# EAGLE design xiao_rp2040_round_lcd (EAGLE 7.7.0)
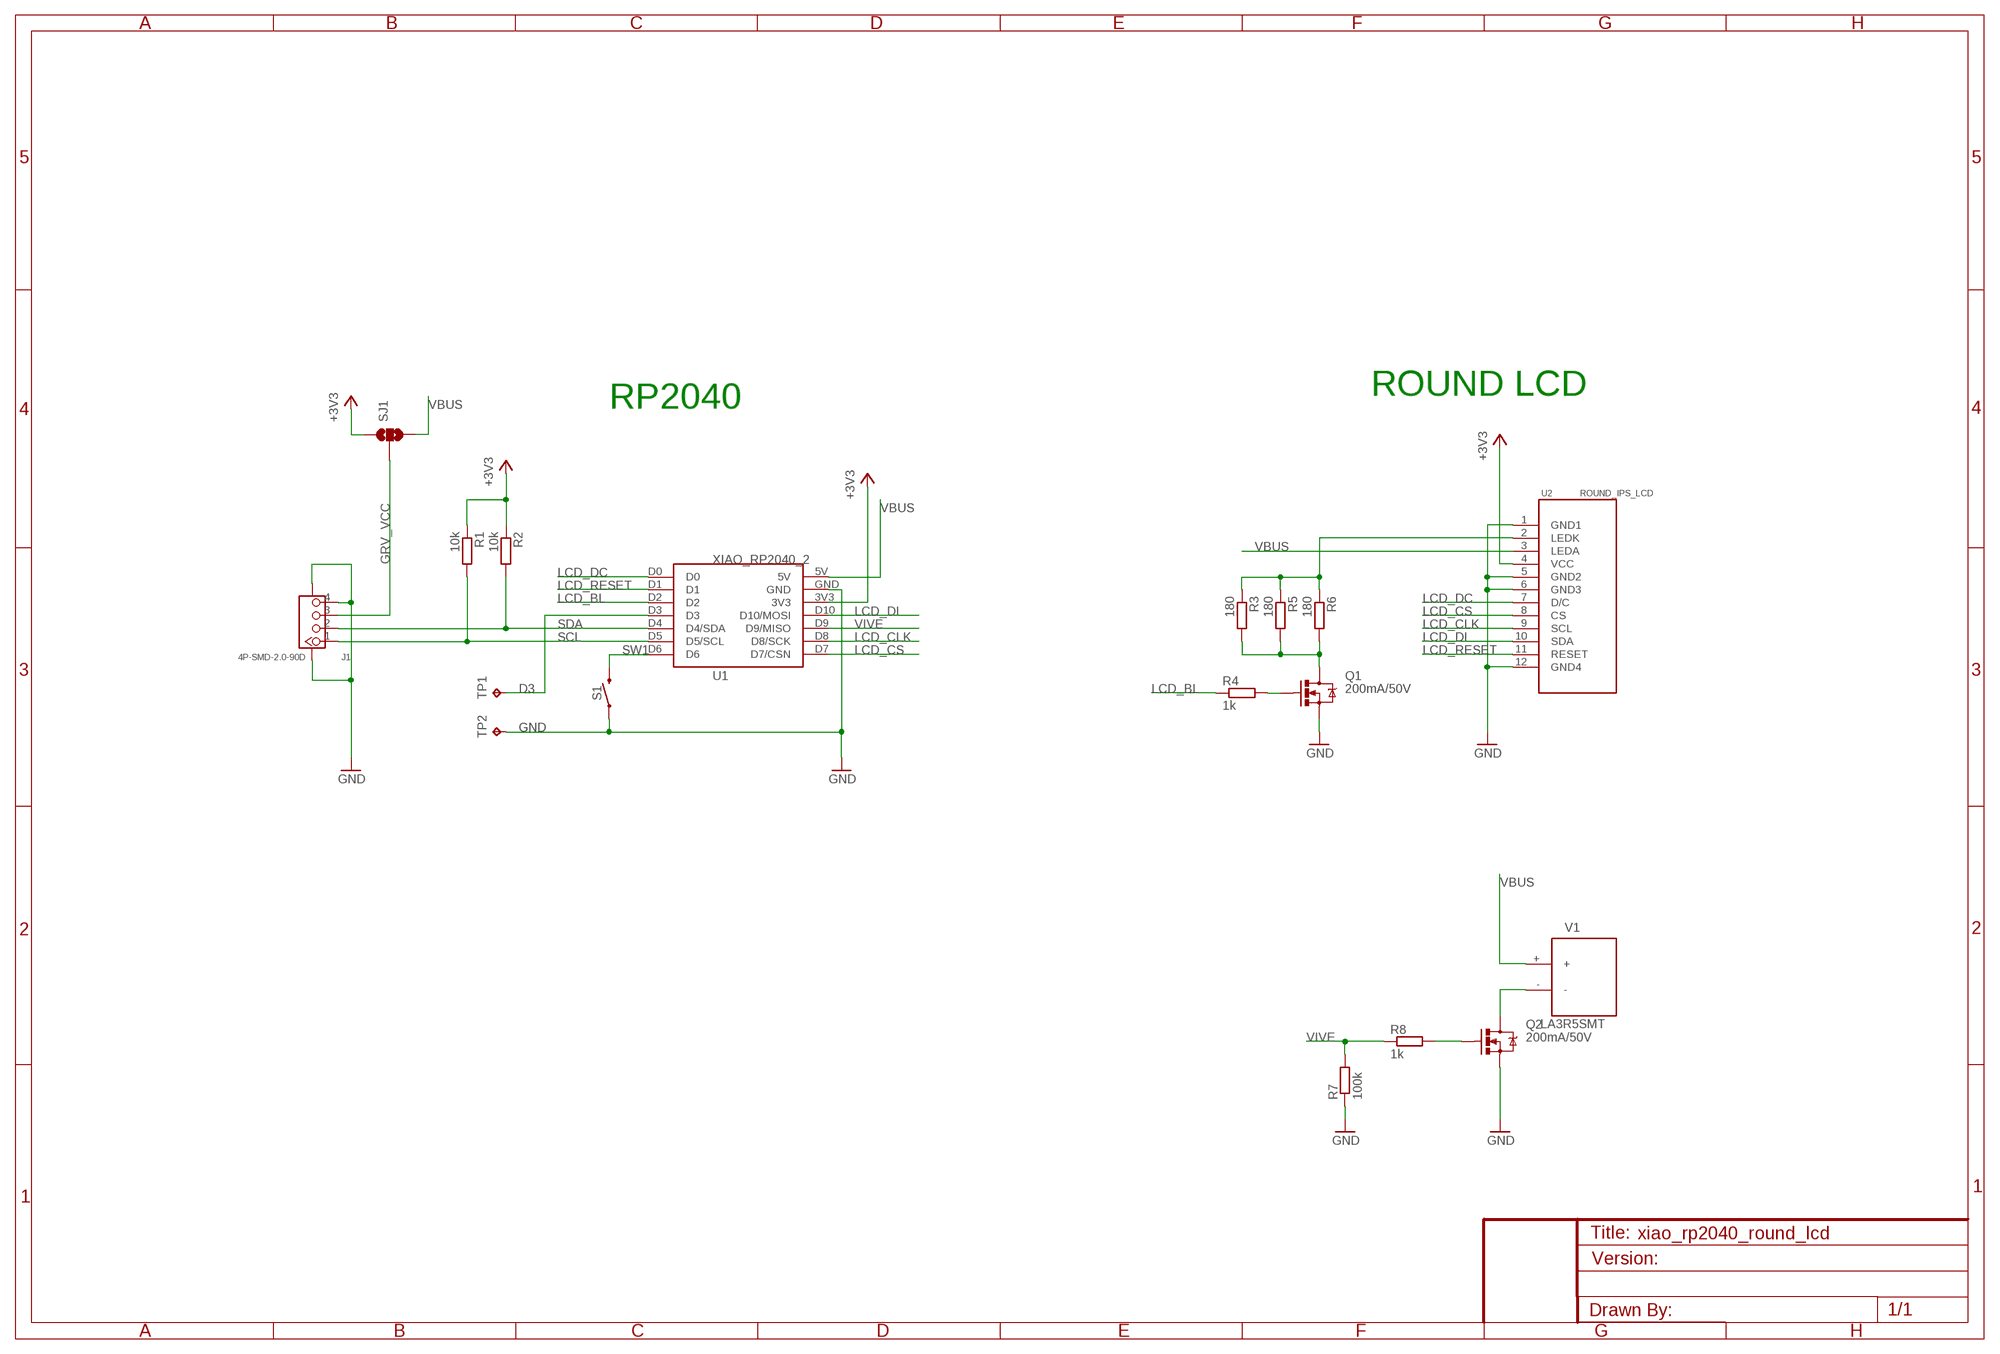
[diagram p0: schematic, sheet 1]

## Parts
J1  4P-SMD-2.0-90D  GROVE-CONNECTOR-SMD-90D(4+2P-2.0)  [HW4-SMD-2.0-90D]
Q1  200mA/50V  MOSFET-NCHANNELBSS138  [SOT23-3]
Q2  200mA/50V  MOSFET-NCHANNELBSS138  [SOT23-3]
R1  10k  R-EU_R0603  [R0603]
R2  10k  R-EU_R0603  [R0603]
R3  180  R-EU_R0603  [R0603]
R4  1k  R-EU_R0603  [R0603]
R5  180  R-EU_R0603  [R0603]
R6  180  R-EU_R0603  [R0603]
R7  100k  R-EU_R0603  [R0603]
R8  1k  R-EU_R0603  [R0603]
S1  TACT_SW_3X4  [TACTILE_SWITCH_SMD_3X4MM]
SJ1  SOLDERJUMPER_2WAYS  [SJ_3]
TP1  TPTP18R  [TP18R]
TP2  TPTP18R  [TP18R]
U1  XIAO_RP2040_2  [XIAO_RP2040_2]
U2  ROUND_IPS_LCD  [ROUND_IPS_LCD]
V1  LA3R5SMT  [LA3R5-2]

## Nets
+3V3 [pow]: R1.1 R2.1 SJ1.1 U1.3V3 U2.4(VCC)
D3: TP1.TP U1.D3
GND: J1.4 J1.SS1 J1.SS2 Q1.2(S) Q2.2(S) R7.1 S1.1 S1.2 TP2.TP U1.GND U2.1(GND1) U2.5(GND2) U2.6(GND3) U2.12(GND4)
GRV_VCC [usbvcc]: J1.3 SJ1.2
LCD_BL: R4.1 U1.D2
LCD_CLK: U1.D8(D8/SCK) U2.9(SCL)
LCD_CS: U1.D7(D7/CSN) U2.8(CS)
LCD_DC: U1.D0 U2.7(D/C)
LCD_DI: U1.D10(D10/MOSI) U2.10(SDA)
LCD_RESET: U1.D1 U2.11(RESET)
LED_K [usbvcc]: R3.1 R5.1 R6.1 U2.2(LEDK)
N$1: Q1.1(G) R4.2
N$2 [usbvcc]: Q1.3(D) R3.2 R5.2 R6.2
N$4: Q2.3(D) V1.-
N$5: Q2.1(G) R8.2
SCL: J1.1 R1.2 U1.D5(D5/SCL)
SDA: J1.2 R2.2 U1.D4(D4/SDA)
SW1: S1.3 S1.4 U1.D6
VBUS [usbvcc]: SJ1.3 U1.5V U2.3(LEDA) V1.+
VIVE: R7.2 R8.1 U1.D9(D9/MISO)

## Notes on the sheet
- ROUND LCD
- RP2040

## Library data of the parts
J1 = Seeed-OPL-Connector:GROVE-CONNECTOR-SMD-90D(4+2P-2.0): 320110032
Q1 Q2 = suna_lib:MOSFET-NCHANNEL: Common NMOSFET Parts MFG P/N Store ID Prod ID FDD8780 TRANS-09984 SI7820DN TRANS-11055 FDS6630A IC-08089 2N7002PW TRANS-11151 FQP30N06L COM-10213 TRANS-10060 BSS123LT1G TRANS-08345 BSS138 TRANS-00830 BS170 2N7000; PROD_ID: TRANS-00830
R1-R8 = resistor:R-EU_: RESISTOR, European symbol
S1 = suna_lib:TACT_SW_3X4
SJ1 = SparkFun-Retired:SOLDERJUMPER_2WAY: Solder Jumper 2 way solder jumper
TP1 TP2 = suna_lib:TP: Test pad
U1 = suna_lib:XIAO_RP2040
U2 = suna_lib:ROUND_IPS_LCD
V1 = suna_lib:LA3R5

## Net classes
1 pow: width 0.508 mm
2 GND: width 0.61 mm
3 usbvcc: width 0.508 mm, clearance 0.254 mm
4 aref: width 0.406 mm, clearance 0.254 mm

## Board
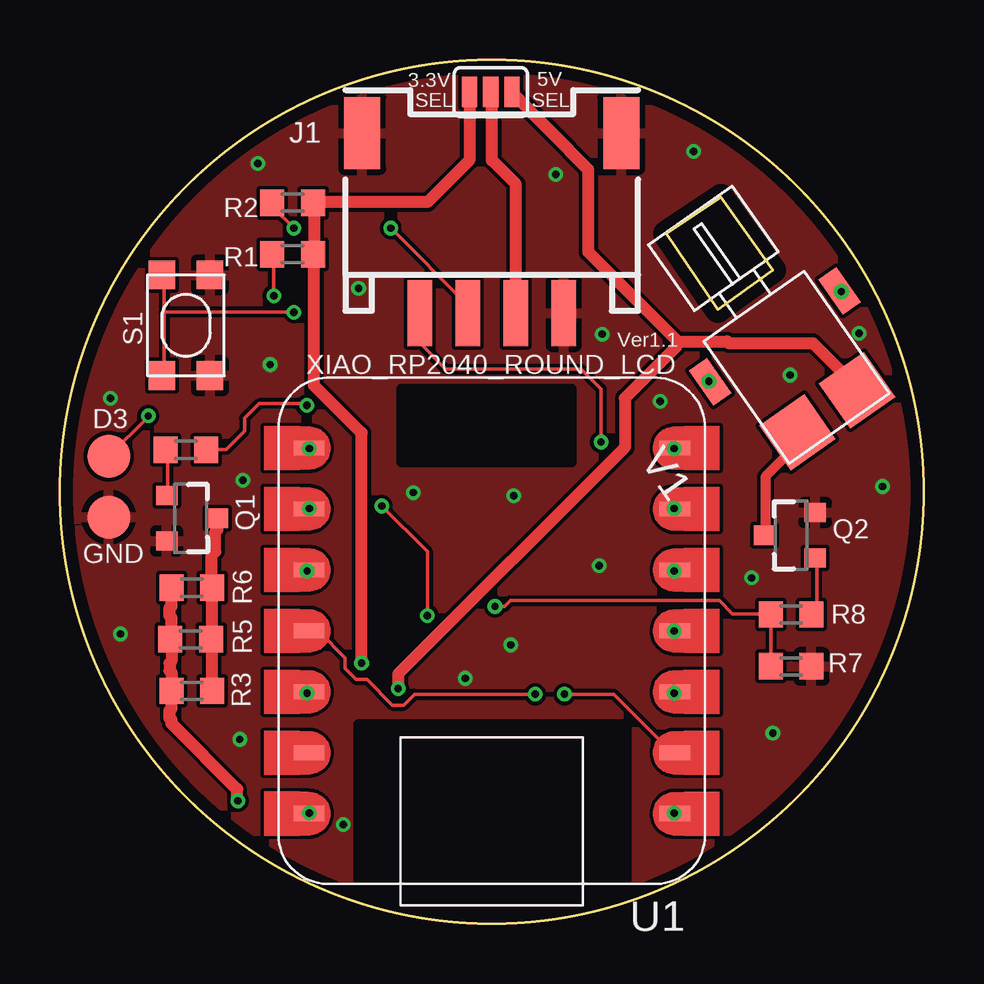
[diagram p1: board, top side]
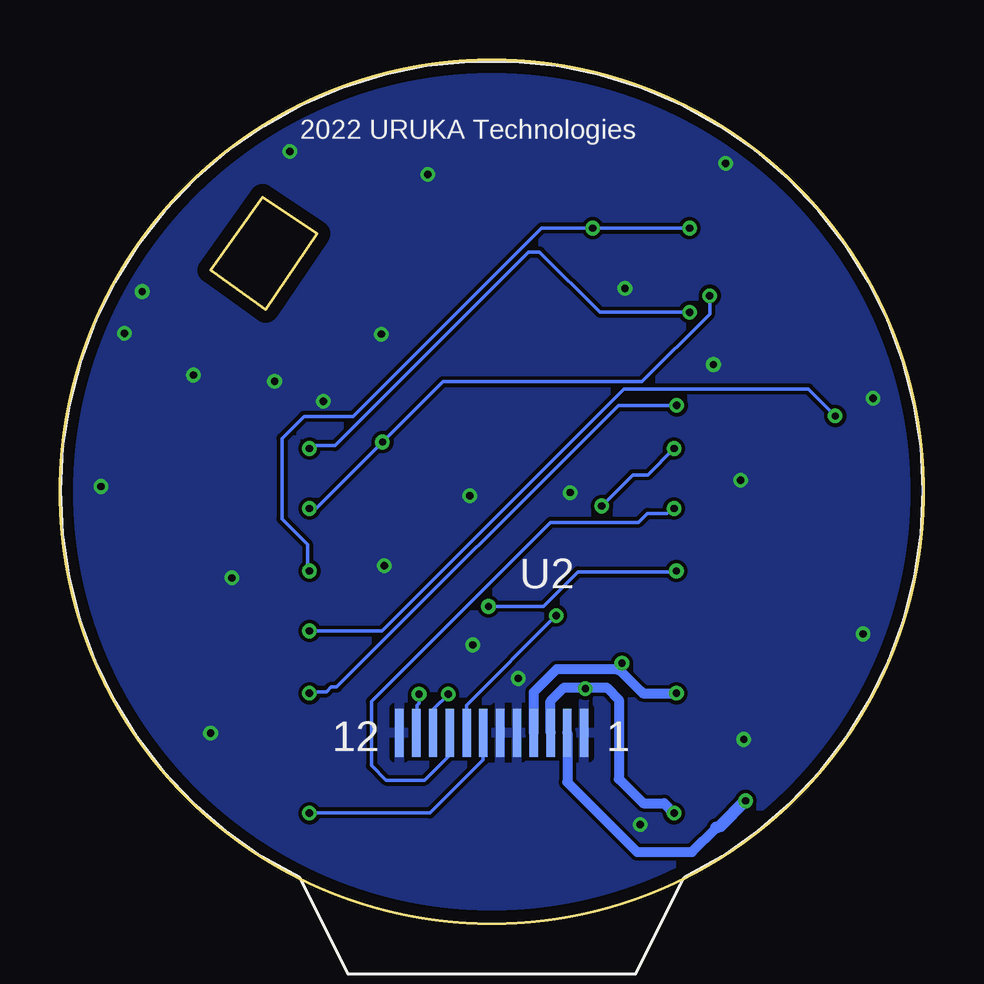
[diagram p2: board, bottom side, seen from below]

Size 36 x 36 mm. Coordinates in mm from the lower left corner, seen from the top.
Outline: 27.56,30.28 25.27,28.76 27.43,25.59 29.72,27.24 27.56,30.28
Outline: circle at 18,18 radius 18
Copper layers (1*16): Top 0.035mm / dielectric 1.53mm / Bottom 0.035mm
Design rules "seeed_pban_5mil": minimum track width 6mil, minimum drill 12mil, track to track 6mil, track to pad 0.229mm, pad to pad 6mil, via to via 6mil, smd to smd 5mil, copper to edge 0.5mm, drill to drill 0.5mm, minimum pad ring 10mil, minimum via ring 6mil, stop-mask expansion 4mil, vias tented up to drill 25mil, thermal gap 10mil
tRestrict: area 12.4,2 to 23.6,8.3; area 14.2,19.2 to 21.3,22.3

### Footprints (pad centres in the part's own frame; a part is rotated, then mirrored left to right if it is on the bottom)
HW4-SMD-2.0-90D = smd 1.01 x 2.74: 1 -3,-0.1; 2 -1,-0.1; 3 1,-0.1; 4 3,-0.1 | smd 1.5 x 3: SS1 -5.4,7.4; SS2 5.4,7.4
SOT23-3 = smd 0.8 x 0.9: 1 -0.95,-1; 2 0.95,-1; 3 0,1.1
R0603 = smd 1 x 1.1: 1 -0.85,0; 2 0.85,0
TACTILE_SWITCH_SMD_3X4MM = smd 1.2 x 1.1: 1 -2.1,-1; 2 2.1,-1; 3 2.1,1; 4 -2.1,1
SJ_3 = smd 0.635 x 1.27: 1 -0.889,0; 2 0,0; 3 0.889,0
TP18R = smd 1.8 x 1.8: TP 0,0
XIAO_RP2040_2 = smd 1.27 x 0.635: 3V3 7.62,2.54; 5V 7.62,7.62; D0 -7.62,7.62; D1 -7.62,5.08; D2 -7.62,2.54; D3 -7.62,0; D4 -7.62,-2.54; D5 -7.62,-5.08; D6 -7.62,-7.62; D7 7.62,-7.62; D8 7.62,-5.08; D9 7.62,-2.54; D10 7.62,0; GND 7.62,5.08
ROUND_IPS_LCD = smd 0.35 x 2: 1 3.85,-9.95; 2 3.15,-9.95; 3 2.45,-9.95; 4 1.75,-9.95; 5 1.05,-9.95; 6 0.35,-9.95; 7 -0.35,-9.95; 8 -1.05,-9.95; 9 -1.75,-9.95; 10 -2.45,-9.95; 11 -3.15,-9.95; 12 -3.85,-9.95
LA3R5-2 = smd 2.286 x 2.286: + -2.54,-1.524; - -2.54,1.524 | smd 1.778 x 0.914: GND1 1.27,3.302; GND2 1.27,-3.302

### Placement (x,y rotation side)
J1  18,25.55 0 top
Q1  5.45,16.9 270 top
Q2  30.48,16.19 90 top
R1  9.7,27.9 180 top
R2  9.7,30.05 180 top
R3  5.5,9.7 0 top
R4  5.25,19.75 180 top
R5  5.45,11.85 0 top
R6  5.5,14 0 top
R7  30.48,10.73 180 top
R8  30.48,12.89 0 top
S1  5.25,24.94 90 top
SJ1  17.96,34.66 0 top
TP1  2.04,19.48 0 top
TP2  2.04,16.94 0 top
U1  18,12.2 180 top
U2  18,17.9 0 bottom
V1  30.53,23.44 125 top

### Tracks (layer width: path | path; a pad name or v marks a point on that pad's centre or on a via)
+3V3  (via drill 0.3)
  Top 0.152: v10.3,9.6 10.3,9.68 U1.3V3
  Top 0.508: v12.57,10.85 12.57,20.45 10.59,22.44 10.59,27.69 R1.1 10.59,27.92 10.59,29.98 R2.1 10.58,30.08 15.32,30.08 17.07,31.83 SJ1.1
  Bottom 0.152: 11.76,9.66 11.7,9.6
  Bottom 0.406: U2.4 16.25,9.65 15.3,10.6 12.7,10.6 11.76,9.66 | 11.7,9.6 10.44,9.6 U1.3V3 10.28,9.58 v10.3,9.6
  Bottom 0.508: v12.57,10.85 12.65,10.78 12.7,10.6
D3  (via drill 0.3)
  Top 0.152: v3.68,21.16 3.68,21.12 TP1.TP | v25.6,12.2 25.62,12.3 U1.D3
  Bottom 0.152: v3.68,21.16 4.8,22.28 12.5,22.28 22.58,12.2 v25.6,12.2
GND  (via drill 0.3)
  other vias: 29.72,7.93 20.66,31.23 8.26,31.68 26.42,32.19 33.31,24.6 30.44,22.86 25.02,21.78 22.61,24.57 8.76,23.3 2.11,21.9 18.92,17.84 14.73,17.97 22.48,14.92 18.8,11.62 7.49,7.68 28.83,14.41 7.62,18.47 11.81,4.12 34.29,18.22 12.45,26.47 16.89,10.22 32.57,26.34 27.05,22.6 2.52,12.07
  pour Top: -1.02,-2.61 37.08,-2.35 37.08,37.02 -1.02,36.76
  pour Bottom: -0.51,-1.34 37.08,-1.34 37.08,37.52 -0.51,37.52
GRV_VCC
  Top 0.508: J1.3 19,30.82 18,31.82 18,34.56 SJ1.2
LCD_BL  (via drill 0.3)
  Top 0.152: v10.29,21.6 10.21,21.67 8.31,21.67 7.7,21.06 7.7,20.53 6.93,19.77 6.17,19.77 R4.1 | v25.6,9.6 25.6,9.68 U1.D2
  Bottom 0.152: v10.29,21.6 12.72,21.6 24.46,9.86 24.69,9.86 24.89,9.66 U1.D2 | 25.6,9.71 U1.D2 | U1.D2 25.66,9.66 v25.6,9.6
LCD_CLK  (via drill 0.3)
  Top 0.152: U1.D8 10.88,17.28 v10.4,17.3
  Bottom 0.152: U2.9 19.81,7.88 19.81,6.97 20.8,5.98 22.4,5.98 23.01,6.59 23.01,9.25 15.54,16.72 11.89,16.72 11.51,17.1 10.7,17.1 v10.4,17.3
LCD_CS  (via drill 0.3)
  Top 0.152: v15.32,12.83 15.32,15.5 v13.41,17.41 | U1.D7 v10.4,19.8
  Bottom 0.152: U2.8 19.05,9.1 v15.32,12.83 | v13.41,17.41 12.12,18.7 11.5,18.7 v10.4,19.8
LCD_DC  (via drill 0.3)
  Top 0.152: v25.6,4.6 25.4,4.36 U1.D0
  Bottom 0.152: U2.7 18.36,7.88 18.36,6.81 20.57,4.61 v25.59,4.61 v25.6,4.6 | v25.6,4.61 U1.D0 | v25.6,4.6 U1.D0 | U1.D0 25.58,4.58 v25.6,4.6
LCD_DI  (via drill 0.3)
  Top 0.152: v19.81,9.56 14.78,9.56 14.33,9.1 13.87,9.1 12.8,10.17 12.34,10.17 11.89,10.62 11.89,11.08 10.82,12.15 10.44,12.15 U1.D10
  Bottom 0.152: v19.81,9.56 20.42,8.95 20.42,7.96 U2.10
LCD_RESET  (via drill 0.3)
  Top 0.152: v21.03,9.56 23.09,9.56 25.6,7.04 U1.D1
  Bottom 0.152: v21.03,9.56 21.03,9.18 21.11,9.1 21.11,7.96 U2.11
LED_K  (via drill 0.3)
  Top 0.508: R6.1 4.65,13.98 4.65,13.22 4.57,13.14 4.57,12.83 4.65,12.76 4.65,12.07 R5.1 4.65,11.84 4.65,10.93 4.57,10.85 4.57,10.55 4.65,10.47 R3.1 4.65,9.48 4.65,8.95 4.57,8.87 4.57,8.57 4.65,8.49 4.65,8.34 7.39,5.6 7.39,5.14 v7.42,5.11
  Bottom 0.406: U2.2 14.85,5.89 11.94,2.98 9.65,2.98 8.64,4
  Bottom 0.508: v7.42,5.11 8.46,4.07 8.64,4
N$1
  Top 0.152: Q1.1 4.5,17.86 4.5,19.62 4.42,19.69 R4.2
N$2
  Top 0.508: R3.2 6.33,9.71 6.33,11.84 R5.2 6.33,12.07 6.33,13.67 6.17,13.83 R6.2 6.33,14.05 6.33,15.35 6.48,15.5 6.48,16.34 6.55,16.42 6.55,16.87 Q1.3
N$4
  Top 0.152: 30.86,20.07 30.86,20.3 V1.- | 29.41,16.19 Q2.3
  Top 0.406: 29.41,16.19 29.41,18.63 30.86,20.07
N$5
  Top 0.152: Q2.1 31.55,15.2 31.55,13.06 31.39,12.91 R8.2
SCL  (via drill 0.3)
  Top 0.152: v22.55,20.07 22.55,22.28 21.72,23.12 16.08,23.12 15.01,24.19 15.01,25.41 J1.1 | v8.91,26.17 8.91,27.85 R1.2 | 25.5,17.4 v25.6,17.3 U1.D5
  Bottom 0.152: v8.91,26.17 8.91,25.41 11.73,22.59 20.04,22.59 v22.55,20.07 25.3,17.33 25.57,17.33 v25.6,17.3 | v25.6,17.3 U1.D5 25.58,17.28 v25.6,17.3
SDA  (via drill 0.3)
  Top 0.152: v9.75,28.99 8.91,29.83 8.91,29.98 R2.2 | v13.79,28.99 16.99,25.79 16.99,25.48 J1.2 | v25.6,14.7 25.56,14.7 U1.D4
  Bottom 0.152: v9.75,28.99 v13.79,28.99 15.93,28.99 23.77,21.14 25.83,21.14 26.75,20.23 26.75,16.87 25.68,15.81 25.68,14.8 U1.D4 25.62,14.72 v25.6,14.7
SW1  (via drill 0.3)
  Top 0.152: 4.34,25.48 4.34,27.01 S1.3 | 4.34,25.48 4.34,22.89 S1.4 | v9.75,25.48 4.34,25.48 | U1.D6 26.18,19.82 v25.6,19.8
  Bottom 0.152: v9.75,25.48 13.49,25.48 16,28 16.46,28 24.54,19.92 25.48,19.92 v25.6,19.8
VBUS  (via drill 0.3)
  Top 0.152: v10.4,4.6 10.36,4.6 U1.5V
  Top 0.508: 25.76,24.26 22.02,28 22.02,31.43 SJ1.3 | V1.+ 33.3,22.13 33.3,22.28 31.39,24.19 27.89,24.19 27.81,24.26 25.76,24.26 | v14.1,9.79 14.1,10.4 23.55,19.85 23.55,21.9 25.68,24.04 25.76,24.26
  Bottom 0.406: U2.3 15.55,9.27 14.99,9.84 14.1,9.84 13.21,9.84 12.7,9.33 12.7,6.03 11.68,5.01 10.81,5.01 v10.4,4.6
  Bottom 0.508: v14.1,9.79 14.1,9.84
VIVE  (via drill 0.3)
  Top 0.152: R7.2 29.64,10.78 29.64,12.83 R8.1 29.57,12.91 28.04,12.91 27.49,13.46 18.78,13.46 18.54,13.22 v18.14,13.22 | v10.3,14.7 10.44,14.8 U1.D9
  Bottom 0.152: v18.14,13.22 15.85,13.22 14.4,14.66 10.46,14.66 U1.D9 | 10.44,14.66 U1.D9 | U1.D9 10.38,14.68 v10.3,14.7

### Text on the board
tPlace: 3.3V | 5V | SEL | SEL | Ver1.1 | XIAO_RP2040_ROUND_LCD | D3 | GND
bPlace: 2022 URUKA Technologies